# Altium schematic sheet besc io pm sch.SchDoc
size A4
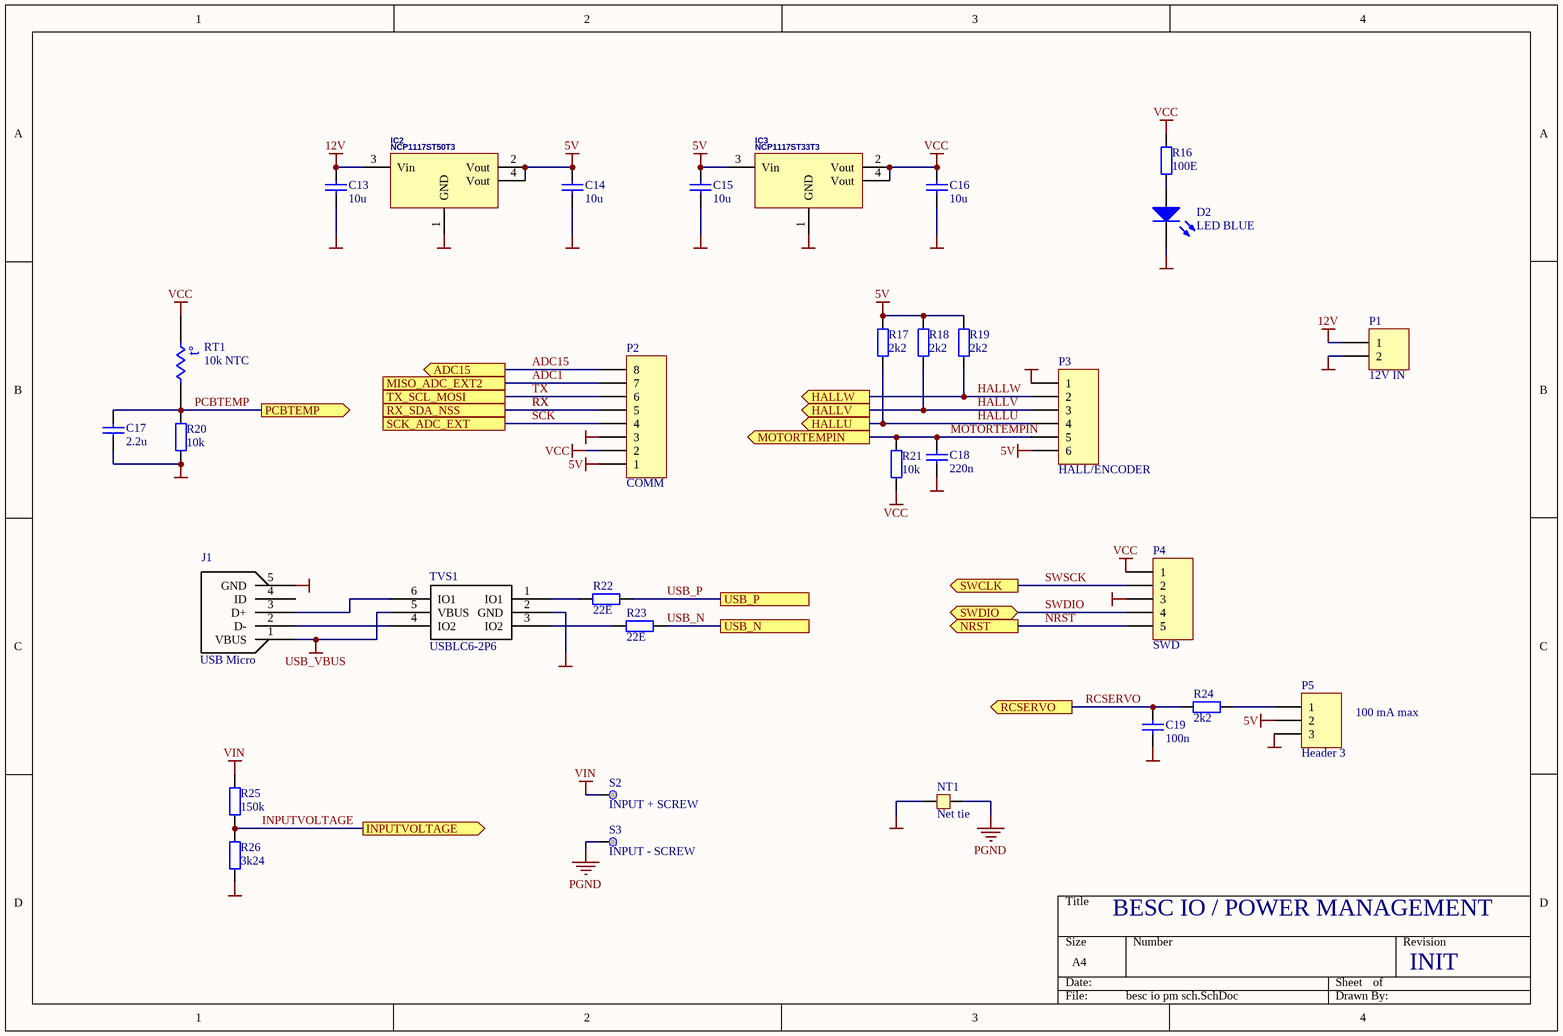
[diagram p0: besc io pm sch.SchDoc]

## Parts
C13  10u  [0805]
C14  10u  [0805]
C15  10u  [0805]
C16  10u  [0805]
C17  2.2u  [0603]
C18  220n  [0603]
C19  100n  [0603]
D2  LED BLUE  [0805-diode]
IC2  NCP1117ST50T3  [SOT223_M]
IC3  NCP1117ST33T3  [SOT223_M]
J1  USB Micro  [MOLEX - 47346-0001 - MICRO USB TYPE B, RECEPTACLE, BOTTOM]
NT1  Net tie  [NETTIE12mil]
P1  12V IN  [JST SM02B-PASS-TB]
P2  COMM  [JST SM08B-PASS-TB]
P3  HALL/ENCODER  [JST SM06B-PASS-TB]
P4  SWD  [Header 1x5 male]
P5  Header 3  [JST SM03B-PASS-TB]
R16  100E  [0603]
R17  2k2  [0603]
R18  2k2  [0603]
R19  2k2  [0603]
R20  10k  [0603]
R21  10k  [0603]
R22  22E  [0603]
R23  22E  [0603]
R24  2k2  [0603]
R25  150k  [0603]
R26  3k24  [0603]
RT1  10k NTC  [0603]
S2  INPUT + SCREW  [WP-SHFU-M6]
S3  INPUT - SCREW  [WP-SHFU-M6]
TVS1  USBLC6-2P6  [SOT23127P600-8N]

## Ports
ADC15 (out), HALLU (out), HALLV (out), HALLW (out), INPUTVOLTAGE (out), MISO_ADC_EXT2, MOTORTEMPIN (out), NRST (out), PCBTEMP (out), RCSERVO (out), RX_SDA_NSS, SCK_ADC_EXT, SWCLK (out), SWDIO (bidir), TX_SCL_MOSI, USB_N, USB_P

## Nets
5V: C14.1 C15.1 IC2.2(Vout) IC2.4(Vout) IC3.3(Vin) P2.1 P3.6 P5.2 R17.1 R18.1 R19.1
12V: C13.1 IC2.3(Vin) P1.1
LGND: C13.2 C14.2 C15.2 C16.2 C17.2 C18.2 C19.1 D2.2(K) IC2.1(GND) IC3.1(GND) J1.5(GND) NT1.1 P1.2 P2.3 P3.1 P4.3 P5.3 R20.2 R26.2 TVS1.2(GND)
PGND: NT1.2 S3.1
USB_VBUS: J1.1(VBUS) TVS1.5(VBUS)
VCC: C16.1 IC3.2(Vout) IC3.4(Vout) P2.2 P4.1 R16.1 R21.1 RT1.1
VIN: R25.1 S2.1
ADC1: P2.7 ; port MISO_ADC_EXT2
ADC15: P2.8 ; port ADC15
HALLU: P3.4 R17.2 ; port HALLU
HALLV: P3.3 R18.2 ; port HALLV
HALLW: P3.2 R19.2 ; port HALLW
INPUTVOLTAGE: R25.2 R26.1 ; port INPUTVOLTAGE
MOTORTEMPIN: C18.1 P3.5 R21.2 ; port MOTORTEMPIN
NRST: P4.5 ; port NRST
PCBTEMP: C17.1 R20.1 RT1.2 ; port PCBTEMP
RCSERVO: C19.2 R24.1 ; port RCSERVO
RX: P2.5 ; port RX_SDA_NSS
SCK: P2.4 ; port SCK_ADC_EXT
SWDIO: P4.4 ; port SWDIO
SWSCK: P4.2 ; port SWCLK
TX: P2.6 ; port TX_SCL_MOSI
USB_N: R23.1 ; port USB_N
USB_P: R22.1 ; port USB_P
NetD2_1: D2.1(A) R16.2
NetJ1_2: J1.2(D-) TVS1.4(IO2)
NetJ1_3: J1.3(D+) TVS1.6(IO1)
NetP5_1: P5.1 R24.2
NetR22_2: R22.2 TVS1.1(IO1)
NetR23_2: R23.2 TVS1.3(IO2)

Not connected (* = marked no-connect by the designer): J1 4(ID)

## Notes on the sheet
- 100 mA max
- BESC IO / POWER MANAGEMENT
- INIT
- (in symbol Res Thermal) t°

## Library data of the parts
C13-C19 = Cap: Capacitor; Published: 8-Jun-2000; LatestRevisionDate: 17-Jul-2002; LatestRevisionNote: Re-released for DXP Platform.; PackageReference: RAD-0.3; Publisher: Altium Limited; Supplier 1: Farnell; Supplier Part Number 1: 1833862
D2 = LED0: Typical INFRARED GaAs LED; Published: 8-Jun-2000; LatestRevisionDate: 08-Jul-2005; LatestRevisionNote: Mech Layer 1 removed.; PackageReference: LED-0; Publisher: Altium Limited; PackageDescription: LED; 2 Leads
IC2 IC3 = VOLTREG_LD1117S33: DETAILS: LOW DROP VOLTAGE REGULATOR 3V3; PRODUCER: ONSEMI: NCP1117ST33T3; SUPPLIER 4: SILICA
J1 = USB Mini AB: SOCKET, USB MINI-AB THRU HOLE; Manufacturer: MOLEX; Part number: 565790511; Farnel: http://uk.farnell.com/jsp/endecaSearch/partDetail.jsp?SKU=4768292&N=401
P1 = Header 2: JST SM02B-PASS-TB; LatestRevisionDate: 17-Jul-2002; LatestRevisionNote: Re-released for DXP Platform.; Publisher: Altium Limited
P2 = Header 8: JST SM08B-PASS-TB; LatestRevisionDate: 17-Jul-2002; LatestRevisionNote: Re-released for DXP Platform.; Publisher: Altium Limited
P3 = Header 6: JST SM06B-PASS-TB; LatestRevisionDate: 17-Jul-2002; LatestRevisionNote: Re-released for DXP Platform.; Publisher: Altium Limited
P4 = Header 5: Header, 5-Pin; LatestRevisionDate: 17-Jul-2002; LatestRevisionNote: Re-released for DXP Platform.; Publisher: Altium Limited
P5 = Header 3: Header, 3-Pin; LatestRevisionDate: 17-Jul-2002; LatestRevisionNote: Re-released for DXP Platform.; Publisher: Altium Limited
R16-R26 = Res2: Resistor; Published: 8-Jun-2000; LatestRevisionDate: 17-Jul-2002; LatestRevisionNote: Re-released for DXP Platform.; PackageReference: AXIAL-0.4; Publisher: Altium Limited; PackageDescription: Axial Device, Thru-Hole; 2 Leads; 0.4 in Pin Spacing
RT1 = Res Thermal: Thermistor; Published: 24-Mar-1999; LatestRevisionDate: 29-May-2009; LatestRevisionNote: IPC-7351 Footprint Added.; PackageVersion: Mar-2003; PackageReference: 6-0805; Publisher: Altium Limited; PackageDescription: Chip Resistor 0805 Case Size; Code_IPC: RESC2012
S2 S3 = En_pin: 7461098